# Altium project Fan-controler-esp8266.PrjPcb
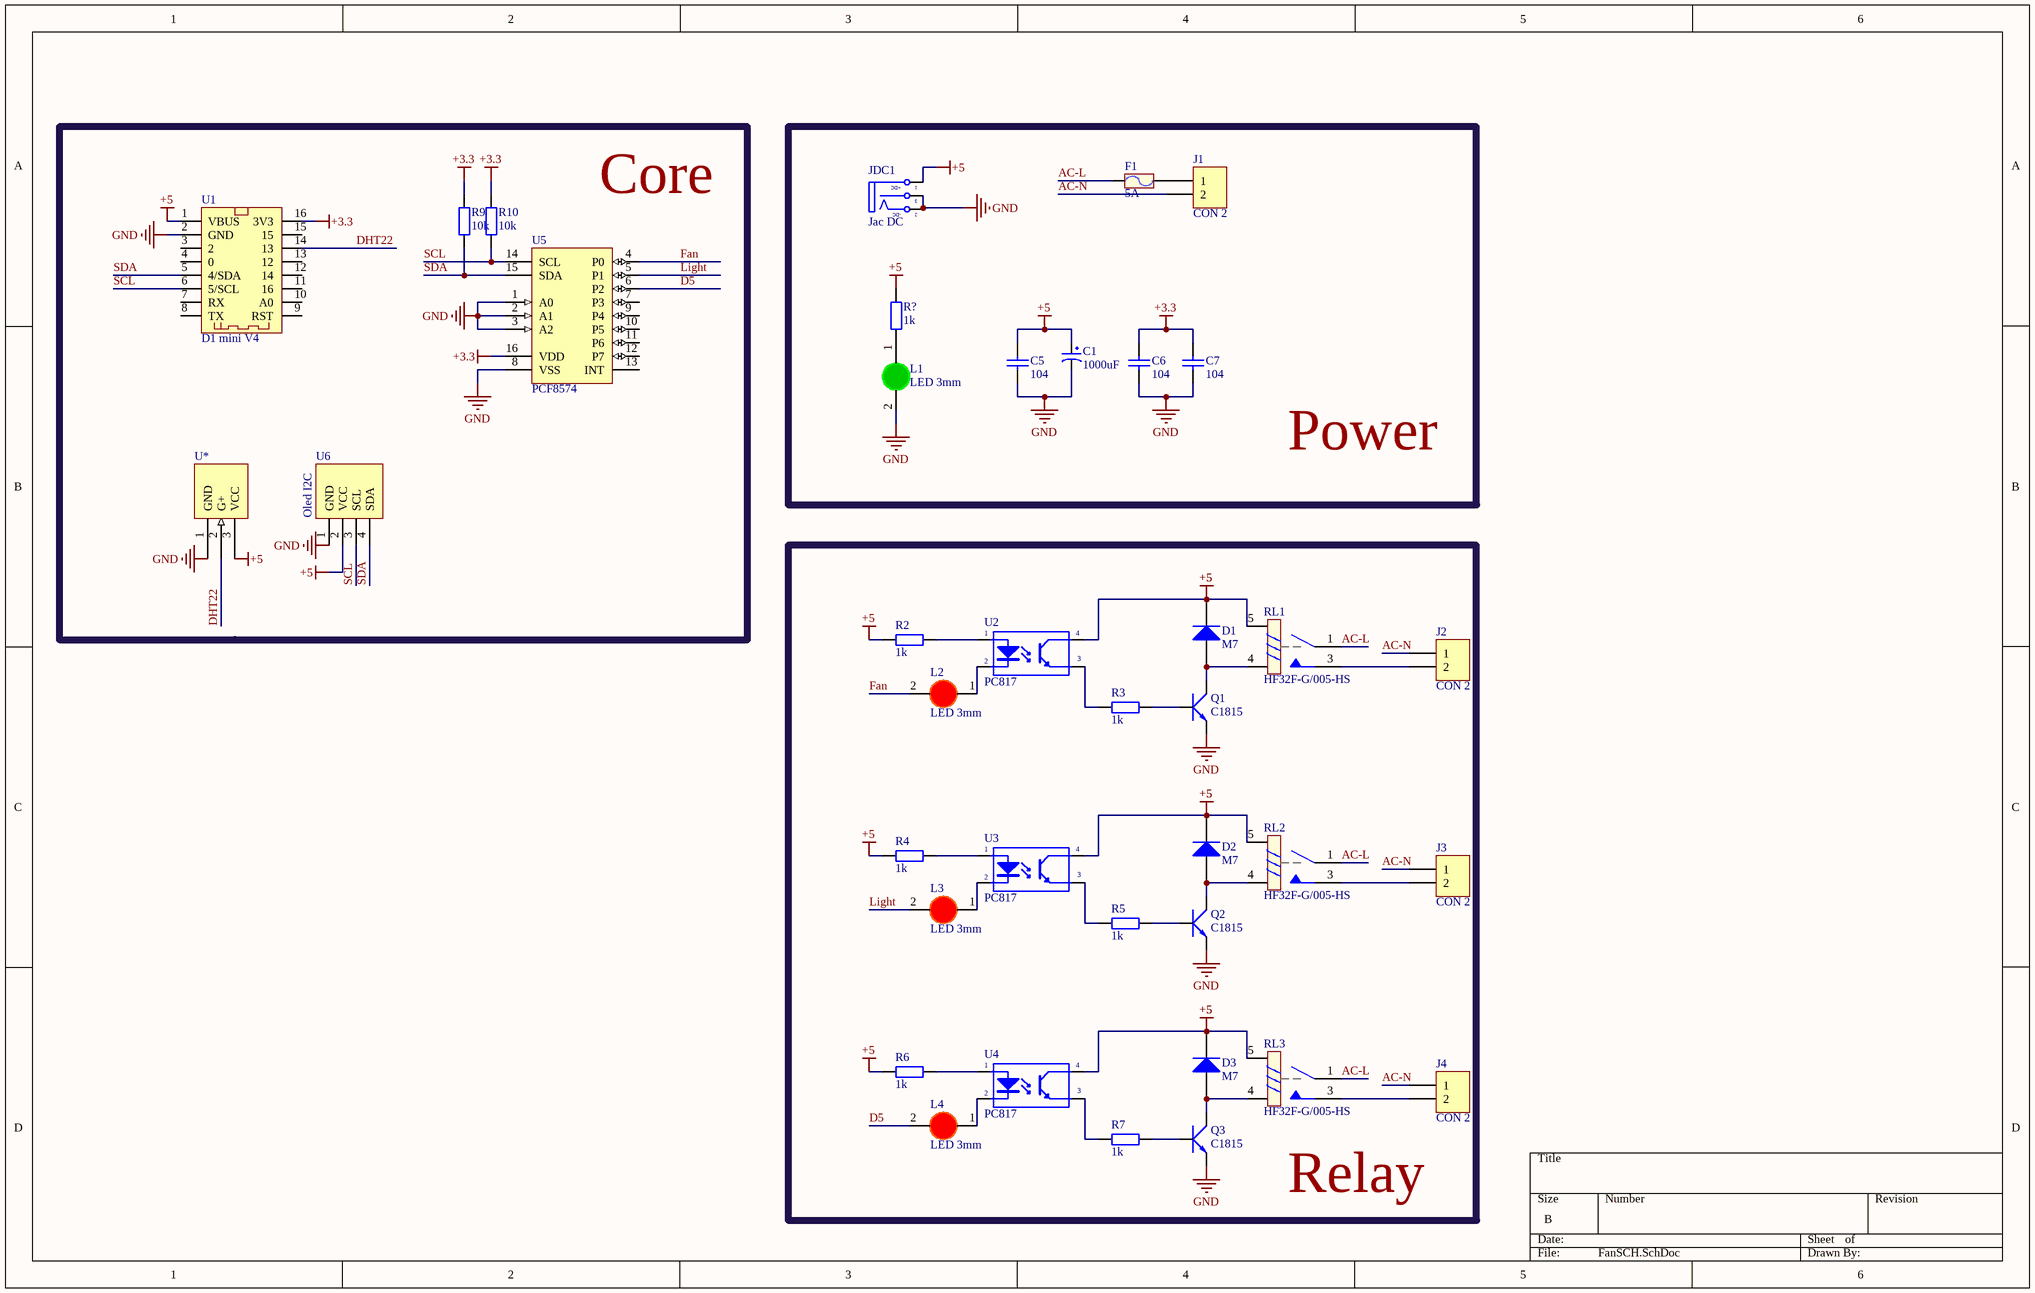
[diagram p0: FanSCH.SchDoc]
1 sheet, 39 parts. Net scope: global (net labels, ports and power ports of the same name join across sheets).
Board file: Fan.PcbDoc

## Sheet FanSCH.SchDoc
size B; SheetNumber: 1; SheetTotal: 1

### Parts
C1  1000uF  [tu hoa 8mm]
C5  104  [tu 0603]
C6  104  [tu 0603]
C7  104  [tu 0603]
D1  M7  [DIODE SMA]
D2  M7  [DIODE SMA]
D3  M7  [DIODE SMA]
F1  5A  [Fuse rectangular]
J1  CON 2  [CON 2 2EDG5.08]
J2  CON 2  [CON 2 2EDG5.08]
J3  CON 2  [CON 2 2EDG5.08]
J4  CON 2  [CON 2 2EDG5.08]
JDC1  Jac DC  [DC0]
L1  LED 3mm  [LED-3MM-GREEN]
L2  LED 3mm  [LED-3MM-RED]
L3  LED 3mm  [LED-3MM-RED]
L4  LED 3mm  [LED-3MM-RED]
Q1  C1815  [TO92]
Q2  C1815  [TO92]
Q3  C1815  [TO92]
R2  1k  [tro smd 0603]
R3  1k  [tro smd 0603]
R4  1k  [tro smd 0603]
R5  1k  [tro smd 0603]
R6  1k  [tro smd 0603]
R7  1k  [tro smd 0603]
R9  10k  [tro smd 0603]
R10  10k  [tro smd 0603]
R?  1k  [tro smd 0603]
RL1  HF32F-G/005-HS  [HF32F-G]
RL2  HF32F-G/005-HS  [HF32F-G]
RL3  HF32F-G/005-HS  [HF32F-G]
U1  D1 mini V4  [WEMOS D1 MINI V4 USD]
U2  PC817  [DIP4]
U3  PC817  [DIP4]
U4  PC817  [DIP4]
U5  PCF8574  [DIP16]
U6  Oled I2C  [Oled]
U*  Line-sensor  [line-sensor]  (value not drawn)

### Nets
+3.3: C6.2 C7.2 R9.2 R10.2 U1.16(3V3) U5.16(VDD)
+5: C1.1 C5.2 D1.2(K) D2.2(K) D3.2(K) JDC1.1(T) R2.1 R4.1 R6.1 R?.2 RL1.5 RL2.5 RL3.5 U1.1(VBUS) U2.4(C) U3.4(C) U4.4(C) U6.2(VCC) U*.3(VCC)
GND: C1.2 C5.1 C6.1 C7.1 JDC1.2(TN) JDC1.3(S) L1.2(K) Q1.1(E) Q2.1(E) Q3.1(E) U1.2(GND) U5.1(A0) U5.2(A1) U5.3(A2) U5.8(VSS) U6.1(GND) U*.1(GND)
AC-L: F1.1 RL1.1 RL2.1 RL3.1
AC-N: J1.2 J2.1 J3.1 J4.1
D5: L4.2(K) U5.6(P2)
DHT22: U1.14(13) U*.2(G+)
Fan: L2.2(K) U5.4(P0)
Light: L3.2(K) U5.5(P1)
SCL: R10.1 U1.6(5/SCL) U5.14(SCL) U6.3(SCL)
SDA: R9.1 U1.5(4/SDA) U5.15(SDA) U6.4(SDA)
NetD1_1: D1.1(A) Q1.2(C) RL1.4
NetD2_1: D2.1(A) Q2.2(C) RL2.4
NetD3_1: D3.1(A) Q3.2(C) RL3.4
NetF1_2: F1.2 J1.1
NetJ2_2: J2.2 RL1.3
NetJ3_2: J3.2 RL2.3
NetJ4_2: J4.2 RL3.3
NetL1_1: L1.1(A) R?.1
NetL2_1: L2.1(A) U2.2(K)
NetL3_1: L3.1(A) U3.2(K)
NetL4_1: L4.1(A) U4.2(K)
NetQ1_3: Q1.3(B) R3.2
NetQ2_3: Q2.3(B) R5.2
NetQ3_3: Q3.3(B) R7.2
NetR2_2: R2.2 U2.1(A)
NetR3_1: R3.1 U2.3(E)
NetR4_2: R4.2 U3.1(A)
NetR5_1: R5.1 U3.3(E)
NetR6_2: R6.2 U4.1(A)
NetR7_1: R7.1 U4.3(E)

Not connected (* = marked no-connect by the designer): U1 3(2) 4(0) 7(RX) 8(TX) 9(RST) 10(A0) 11(16) 12(14) 13(12) 15; U5 7(P3) 9(P4) 10(P5) 11(P6) 12(P7) 13(INT)

### Notes on the sheet
- Core
- Power
- Relay
- (in symbol DCIN) +DC; -DC

### Library data of the parts
C1 = Tu Hoa 1000uF 16V 8x20: Cắm; Don_Vi: Con; So_Chan: 2; Ten_Linh_Kien: Tụ Hóa 1000uF 16V 8x20MM; Ma_Hang: MH008300; Chung_Loai: Cắm; Kieu_Chan: *
C5-C7 = Tu 0603 104 50V 10%: Dán; Don_Vi: Con; So_Chan: 2; Ten_Linh_Kien: Tụ 0603 104-100nF 10% 50V; Ma_Hang: MH004568; Chung_Loai: Dán; Kieu_Chan: *
D1-D3 = Diode M7 ( 4007 ): Dán; Don_Vi: Con; Ten_Linh_Kien: Diode M7 1N4007 SMD 1A 1000V; Ma_Hang: MH000944; Chung_Loai: Dán; Ghi_Chu: *
F1 = Fuse: Designed by: VanDungEvn; Value: Fuse
J1-J4 = CON 2 EDG5.08: CON2 KF terminal
JDC1 = DCIN: Jac DC input; Value: Jac DC
L1 = LED 3mm Xanh La: Cắm; Don_Vi: Con; Ma_Hang: MH001054; Ten_Linh_Kien: Led 3MM Phủ Xanh (10c); Ghi_Chu: *; Kieu_Chan: *; Chung_Loai: Cắm
L2-L4 = LED 3mm Do: Cắm; Don_Vi: Con; Ma_Hang: MH003892; Ten_Linh_Kien: Led 3MM Phủ Đỏ (10c); Ghi_Chu: *; Kieu_Chan: *; Chung_Loai: Cắm
Q1-Q3 = Trans C1815 DIP: NPN transistor; Value: C9014
R2-R7 R? = Tro 0603 1% 1k: Dán; So_Chan: 2; Don_Vi: Con; Ten_Linh_Kien: Trở 0603 1% 1k; Ma_Hang: MH006334; Chung_Loai: Dán; Kieu_Chan: *
R9 R10 = Tro 0603 1% 10k: Dán; Don_Vi: Con; So_Chan: 2; Ten_Linh_Kien: Trở 0603 1% 10k; Ma_Hang: MH006333; Chung_Loai: Dán; Kieu_Chan: *
RL1-RL3 = Relay HF 10A: Relay hongfa 10A 4P HF32F-G/005-HS; ComponentLink1Description: Datasheet; ComponentLink1URL: https://pdf1.alldatasheet.com/datasheet-pdf/view/312455/HONGFA/HF32F-G/005-HXXX.html
U1 = Wemos D1 mini V4.0: ESP8266 D1
U2-U4 = PC817: Single Opto; Value: PC817